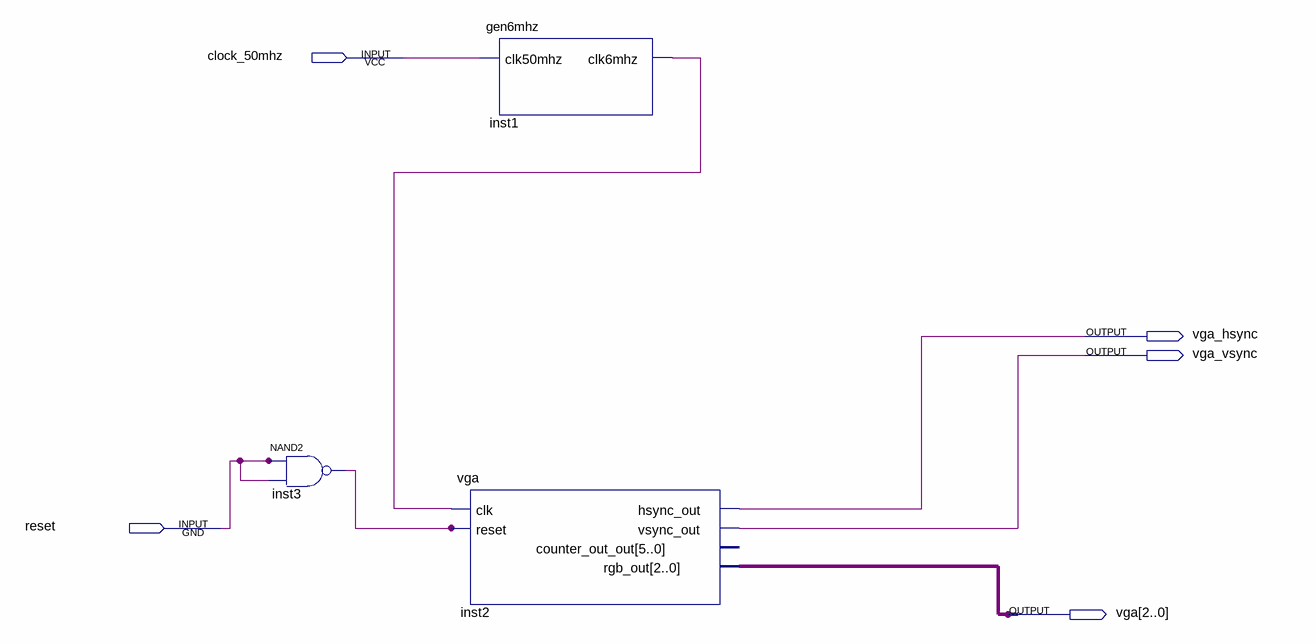
[diagram p0: schematic sheet]
// Quartus schematic top_de1.bdf as structural Verilog: 3 symbols, 5 pins
module top_de1 (
  input  clock_50mhz,
  input  reset,
  output vga_hsync,
  output vga_vsync,
  output [2:0] vga
);

  wire inst1_clk6mhz, inst3_out;

  nand inst3 (inst3_out, reset, reset);
  vga inst2 (
    .clk(inst1_clk6mhz), .reset(inst3_out), .hsync_out(vga_hsync), .vsync_out(vga_vsync), .rgb_out(vga));  // open: counter_out_out
  gen6mhz inst1 (.clk50mhz(clock_50mhz), .clk6mhz(inst1_clk6mhz));
endmodule
